# EAGLE design sensor (EAGLE 9.5.0)
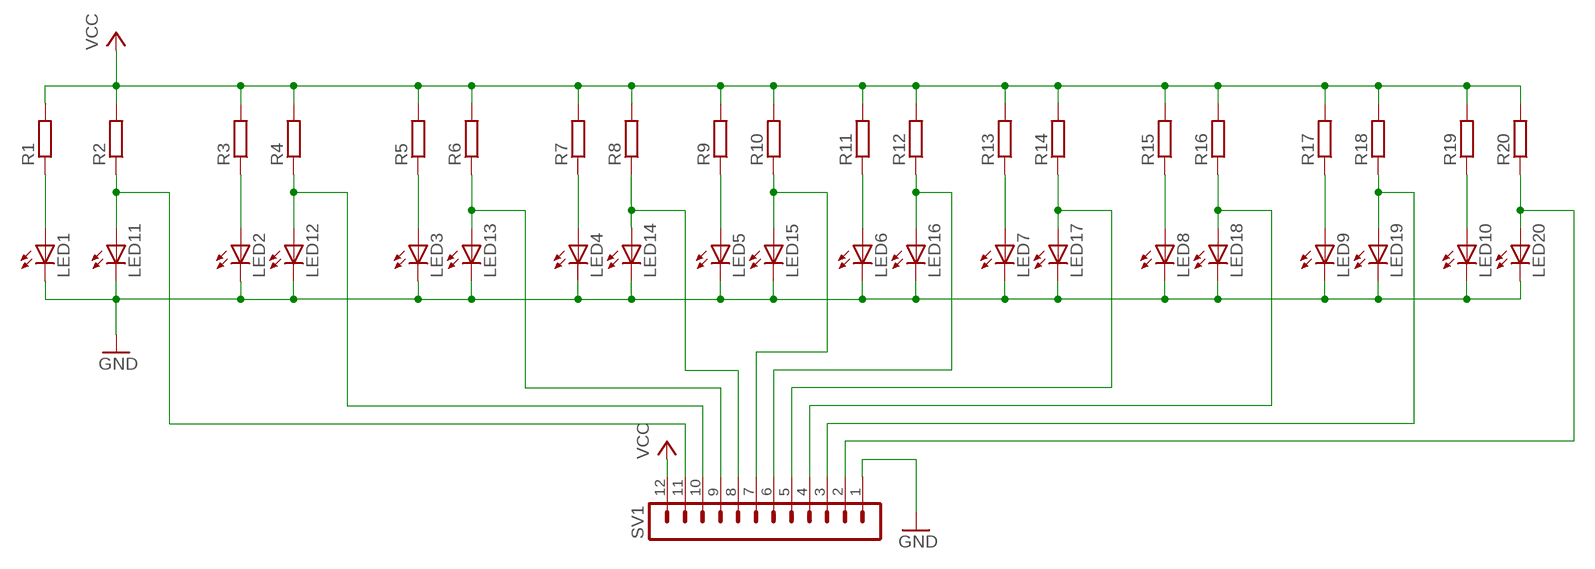
[diagram p0: schematic, sheet 1]

## Parts
LED1  LED3MM  [LED3MM]
LED2  LED3MM  [LED3MM]
LED3  LED3MM  [LED3MM]
LED4  LED3MM  [LED3MM]
LED5  LED3MM  [LED3MM]
LED6  LED3MM  [LED3MM]
LED7  LED3MM  [LED3MM]
LED8  LED3MM  [LED3MM]
LED9  LED3MM  [LED3MM]
LED10  LED3MM  [LED3MM]
LED11  LED3MM  [LED3MM]
LED12  LED3MM  [LED3MM]
LED13  LED3MM  [LED3MM]
LED14  LED3MM  [LED3MM]
LED15  LED3MM  [LED3MM]
LED16  LED3MM  [LED3MM]
LED17  LED3MM  [LED3MM]
LED18  LED3MM  [LED3MM]
LED19  LED3MM  [LED3MM]
LED20  LED3MM  [LED3MM]
R1  R-EU_0207/7  [0207/7]
R2  R-EU_0207/7  [0207/7]
R3  R-EU_0207/7  [0207/7]
R4  R-EU_0207/7  [0207/7]
R5  R-EU_0207/7  [0207/7]
R6  R-EU_0207/7  [0207/7]
R7  R-EU_0207/7  [0207/7]
R8  R-EU_0207/7  [0207/7]
R9  R-EU_0207/7  [0207/7]
R10  R-EU_0207/7  [0207/7]
R11  R-EU_0207/7  [0207/7]
R12  R-EU_0207/7  [0207/7]
R13  R-EU_0207/7  [0207/7]
R14  R-EU_0207/7  [0207/7]
R15  R-EU_0207/7  [0207/7]
R16  R-EU_0207/7  [0207/7]
R17  R-EU_0207/7  [0207/7]
R18  R-EU_0207/7  [0207/7]
R19  R-EU_0207/7  [0207/7]
R20  R-EU_0207/7  [0207/7]
SV1  MA12-1  [MA12-1]

## Nets
GND: LED1.K(C) LED2.K(C) LED3.K(C) LED4.K(C) LED5.K(C) LED6.K(C) LED7.K(C) LED8.K(C) LED9.K(C) LED10.K(C) LED11.K(C) LED12.K(C) LED13.K(C) LED14.K(C) LED15.K(C) LED16.K(C) LED17.K(C) LED18.K(C) LED19.K(C) LED20.K(C) SV1.1
N$1: LED1.A R1.1
N$2: LED11.A R2.1 SV1.11
N$3: LED2.A R3.1
N$4: LED12.A R4.1 SV1.10
N$5: LED3.A R5.1
N$6: LED13.A R6.1 SV1.9
N$7: LED4.A R7.1
N$8: LED14.A R8.1 SV1.8
N$9: LED5.A R9.1
N$10: LED15.A R10.1 SV1.7
N$11: LED6.A R11.1
N$12: LED16.A R12.1 SV1.6
N$13: LED20.A R20.1 SV1.2
N$14: LED10.A R19.1
N$15: LED19.A R18.1 SV1.3
N$16: LED9.A R17.1
N$17: LED18.A R16.1 SV1.4
N$18: LED8.A R15.1
N$19: LED17.A R14.1 SV1.5
N$20: LED7.A R13.1
VCC: R1.2 R2.2 R3.2 R4.2 R5.2 R6.2 R7.2 R8.2 R9.2 R10.2 R11.2 R12.2 R13.2 R14.2 R15.2 R16.2 R17.2 R18.2 R19.2 R20.2 SV1.12

## Library data of the parts
LED1-LED20 = adafruit:LED: LED OSRAM: - CHIPLED LG R971, LG N971, LY N971, LG Q971, LY Q971, LO R971, LY R971 LH N974, LH R974 LS Q976, LO Q976, LY Q976 LO Q996 - Hyper CHIPLED LW Q18S LB Q993, LB Q99A, LB R99A - SideLED LS A670, LO A670, LY A670, LG A670, LP A670 LB A673, LV A673, LT A673, LW A673 LH A674 LY A675 LS A676, LA A676, LO A676, LY A676, LW A676 LS A679, LY A679, LG A679 - Hyper Micro SIDELED® LS Y876, LA Y876, LO Y876, LY Y876 LT Y87S - SmartLED LW L88C, LW L88S LB L89C, LB L89S, LG L890 LS L89K, LO L89K, LY L89K LS L896, LA L896, LO L896, LY L896 - TOPLED LS T670, LO T670, LY T670, LG T670, LP T670 LSG T670, LSP T670, LSY T670, LOP T670, LYG T670 LG T671, LOG T671, LSG T671 LB T673, LV T673, LT T673, LW T673 LH T674 LS T676, LA T676, LO T676, LY T676, LB T676, LH T676, LSB T676, LW T676 LB T67C, LV T67C, LT T67C, LS T67K, LO T67K, LY T67K, LW E67C LS E67B, LA E67B, LO E67B, LY E67B, LB E67C, LV E67C, LT E67C LW T67C LS T679, LY T679, LG T679 LS T770, LO T770, LY T770, LG T770, LP T770 LB T773, LV T773, LT T773, LW T773 LH T774 LS E675, LA E675, LY E675, LS T675 LS T776, LA T776, LO T776, LY T776, LB T776 LHGB T686 LT T68C, LB T68C - Hyper Mini TOPLED® LB M676 - Mini TOPLED Santana® LG M470 LS M47K, LO M47K, LY M47K Source: http://www.osram.convergy.de/
R1-R20 = rcl:R-EU_: RESISTOR, European symbol; SPICEPREFIX: R
SV1 = con-lstb:MA12-1: PIN HEADER; OC_FARNELL: unknown; OC_NEWARK: unknown

## Board
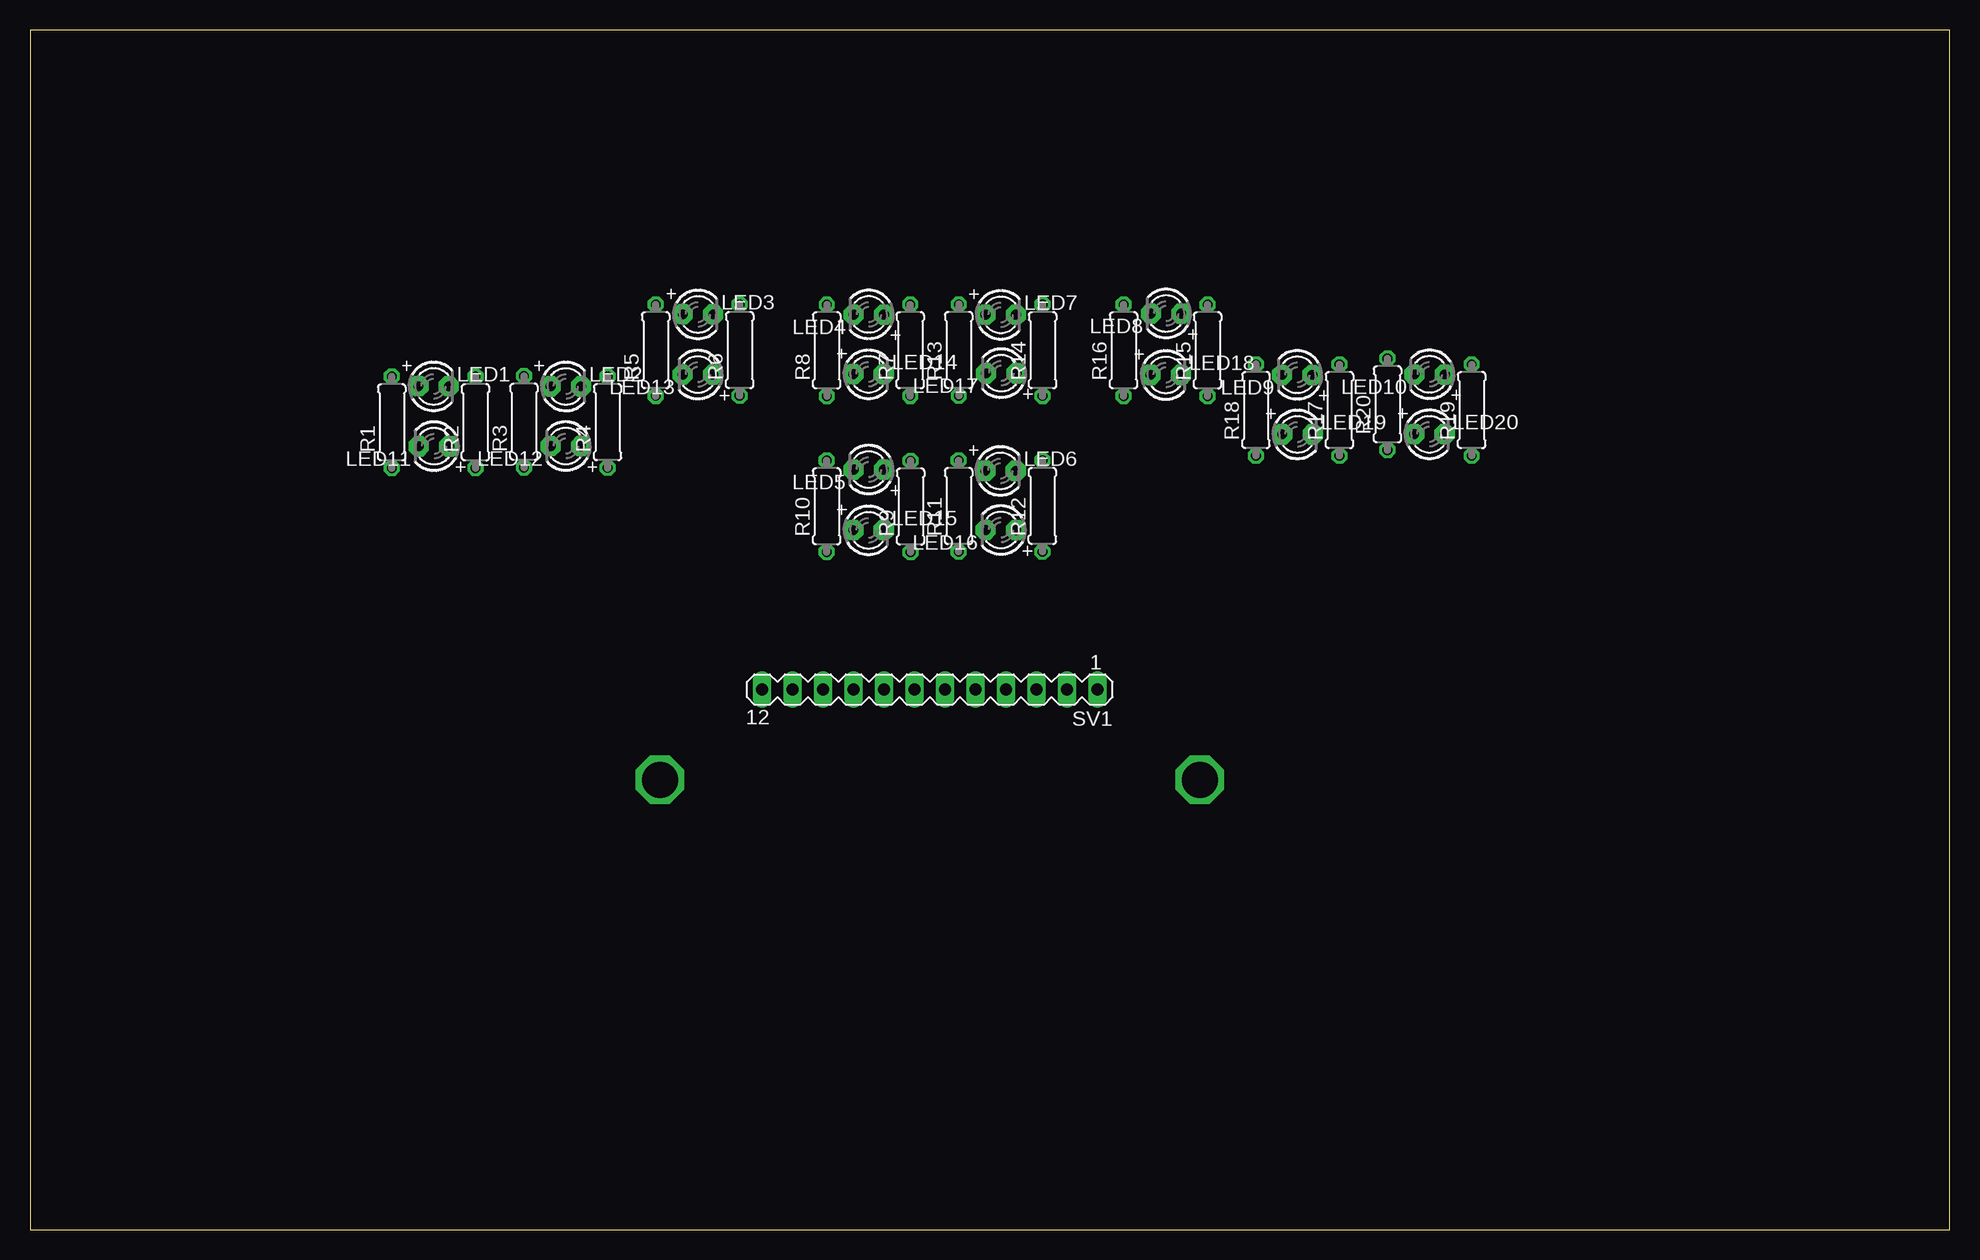
[diagram p1: board, top side]
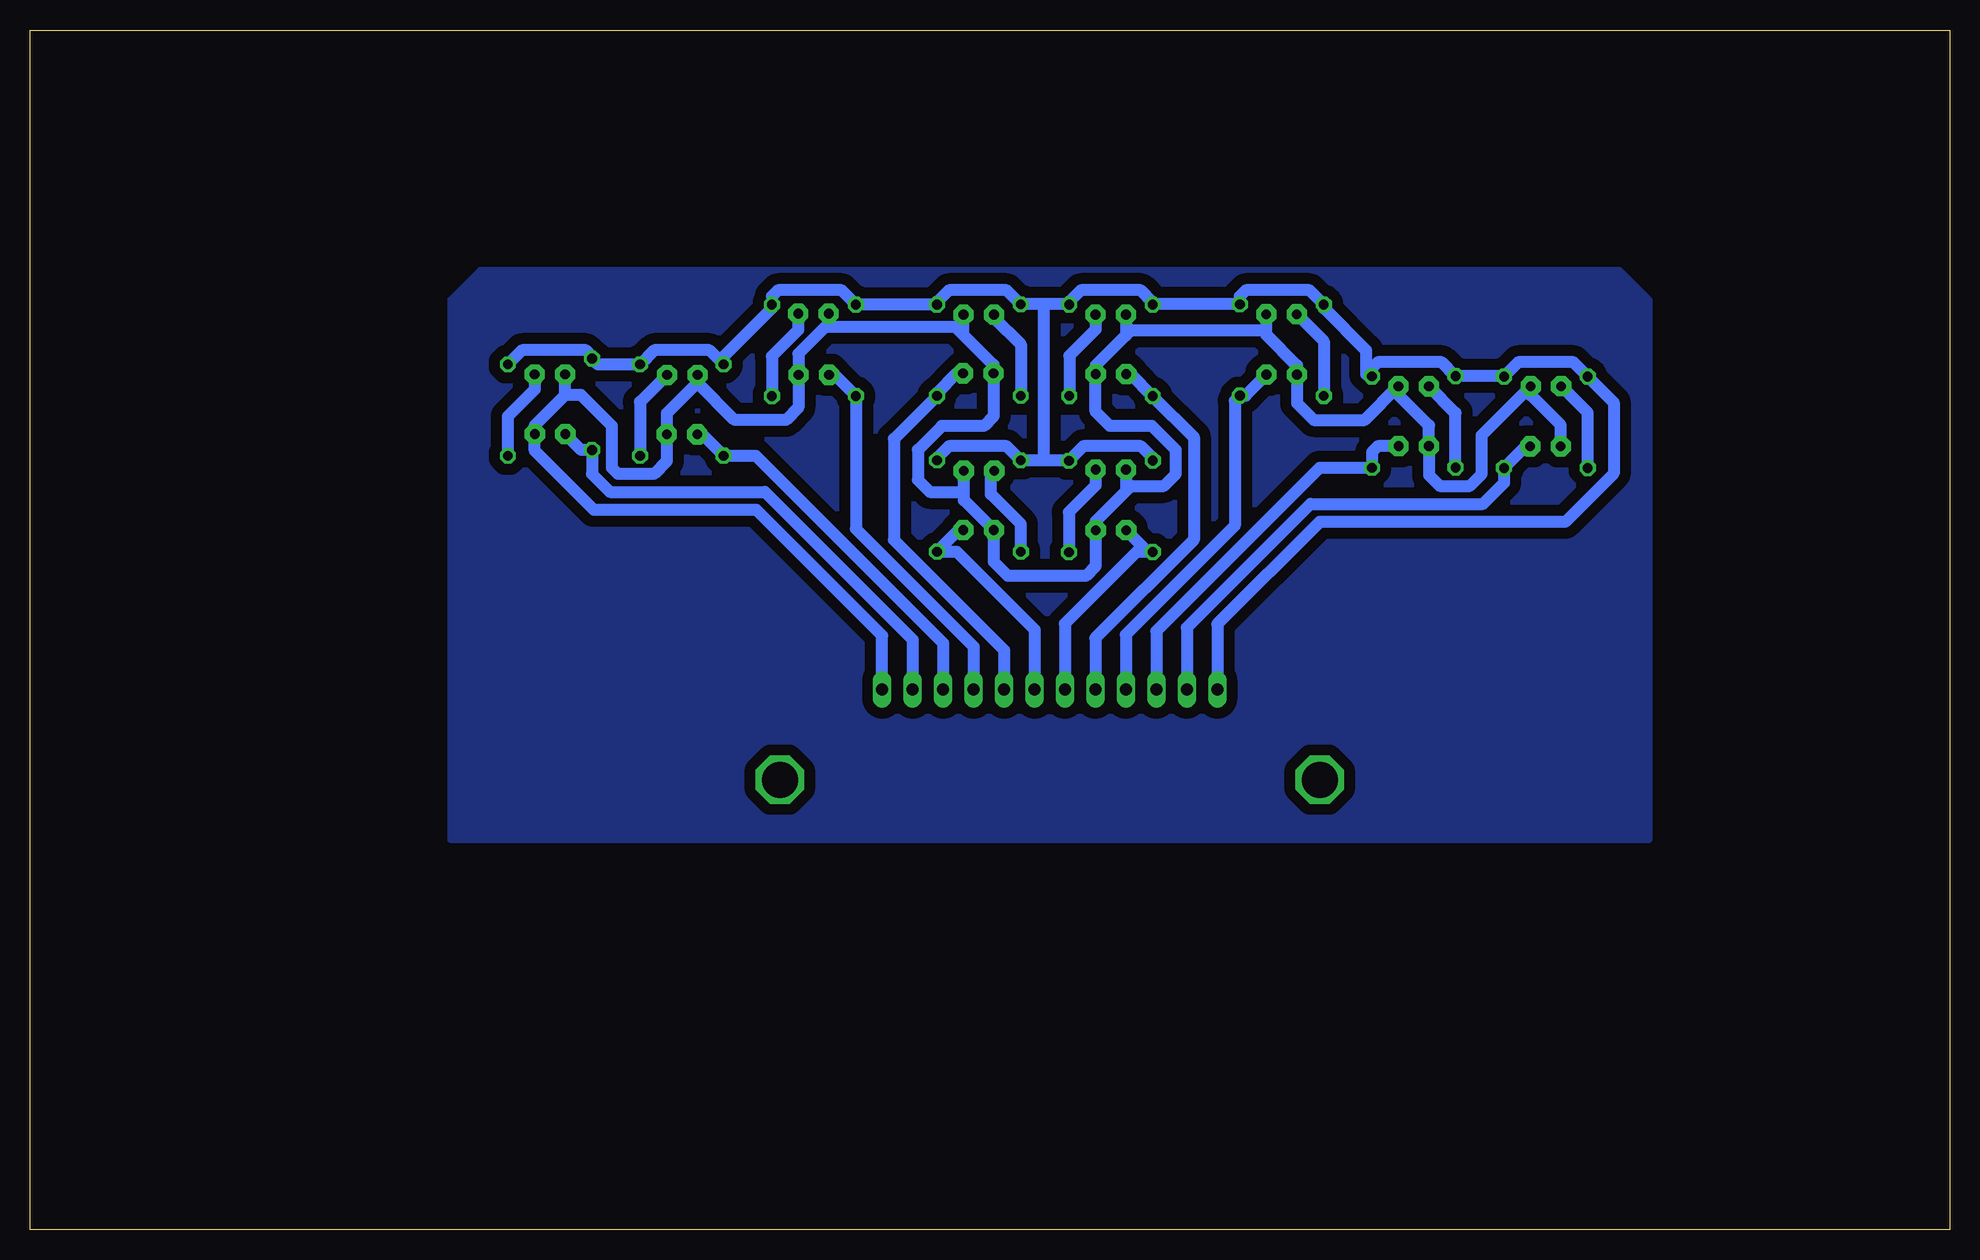
[diagram p2: board, bottom side, seen from below]

Size 160 x 100 mm. Coordinates in mm from the lower left corner, seen from the top.
Outline: 0,0 160,0 160,100 0,100 0,0
Copper layers (1*16): Top 0.035mm / dielectric 1.5mm / Bottom 0.035mm
Design rules "default *": minimum track width 6mil, minimum drill 0.35mm, track to track 36mil, track to pad 36mil, pad to pad 6mil, via to via 6mil, smd to smd 6mil, copper to edge 40mil, drill to drill 6mil, minimum pad ring 10mil, minimum via ring 8mil, stop-mask expansion 4mil, vias tented up to drill 0mil, thermal gap 10mil

### Footprints (pad centres in the part's own frame; a part is rotated, then mirrored left to right if it is on the bottom)
LED3MM = drill 0.813 pad 1.676 octagon: A -1.27,0; K 1.27,0
0207/7 = drill 0.813 octagon: 1 -3.81,0; 2 3.81,0
MA12-1 = drill 1.016 long: 1 -13.97,0; 2 -11.43,0; 3 -8.89,0; 4 -6.35,0; 5 -3.81,0; 6 -1.27,0; 7 1.27,0; 8 3.81,0; 9 6.35,0; 10 8.89,0; 11 11.43,0; 12 13.97,0

### Placement (x,y rotation side)
LED1  33.64,70.3 0 top
LED2  44.67,70.29 0 top
LED3  55.68,76.3 0 top
LED4  69.92,76.28 180 top
LED5  69.91,63.34 180 top
LED6  80.89,63.25 0 top
LED7  80.92,76.26 0 top
LED8  94.7,76.36 180 top
LED9  105.63,71.24 180 top
LED10  116.66,71.29 180 top
LED11  33.68,65.29 180 top
LED12  44.66,65.3 180 top
LED13  55.66,71.27 180 top
LED14  69.9,71.31 0 top
LED15  69.9,58.3 0 top
LED16  80.93,58.31 180 top
LED17  80.96,71.38 180 top
LED18  94.68,71.25 0 top
LED19  105.65,66.3 0 top
LED20  116.65,66.31 0 top
R1  30.16,67.3 90 top
R2  37.13,67.29 90 top
R3  41.18,67.34 90 top
R4  48.15,67.31 90 top
R5  52.16,73.3 90 top
R6  59.15,73.32 90 top
R7  73.37,73.3 90 top
R8  66.42,73.29 90 top
R9  73.4,60.28 90 top
R10  66.41,60.29 90 top
R11  77.41,60.31 90 top
R12  84.39,60.32 90 top
R13  77.42,73.32 90 top
R14  84.41,73.3 90 top
R15  98.16,73.29 90 top
R16  91.16,73.3 90 top
R17  109.15,68.31 90 top
R18  102.19,68.32 90 top
R19  120.17,68.31 90 top
R20  113.15,68.8 90 top
SV1  75,45.02 180 top

### Tracks (layer width: path | path; a pad name or v marks a point on that pad's centre or on a via)
GG
  pour Bottom: 27.5,80 122.5,80 125,77.5 125,32.5 25,32.5 25,77.5
GND
  Bottom 1: LED11.K 32.41,67.05 34.91,69.55 LED1.K 39,66.21 39,63 40,62 42.5,62 43.38,62.88 LED12.K 43.38,67.02 45.94,69.58 LED2.K 48.73,67.5 53,67.5 54.39,68.89 LED13.K 54.39,72.03 56.95,74.59 56.95,75 | 56.95,75 LED3.K | 82.16,61.5 82.16,60.81 LED16.K 79.66,55.66 78.5,54.5 72,54.5 71.17,55.33 LED15.K 71.17,59.04 68.64,61.57 | 82.16,61.5 LED6.K | 82.19,74.58 LED7.K | 82.19,74.58 79.69,72.08 LED17.K 79.69,67.81 80.5,67 84,67 86,65 86,62.5 85,61.5 82.16,61.5 | 68.65,74.56 71.17,72.04 LED14.K 71.17,68.17 70,67 66.5,67 64.5,65 64.5,63 65.5,62 68.21,62 68.64,61.57 | LED8.K 93.43,75.53 93.73,75.23 | 93.73,75.23 95.94,73.01 LED18.K 95.94,68.56 97,67.5 101.25,67.5 104.36,70.6 | LED9.K 104.36,70.6 | 104.36,70.6 106.92,68.03 LED19.K 106.92,64.08 108,63 111,63 111.5,63.5 111.5,67 114.07,69.57 115.39,69.57 | 115.39,69.57 LED10.K | 115.39,69.57 117.92,67.04 LED20.K 117.92,64.92 113,60 99.45,60 88.97,49.52 SV1.1 | LED5.K 68.64,61.57 | LED4.K 68.65,74.56 | 68.65,74.56 68.21,75 56.95,75 | 82.19,74.58 82.84,75.23 93.73,75.23
N$1
  Bottom 1: R1.1 30.16,68.09 LED1.A
N$2
  Bottom 1: LED11.A 35.33,65.29 R2.1 37.13,62.23 38.88,60.48 53.27,60.48 63.57,50.18 SV1.11
N$3
  Bottom 1: R3.1 41.18,68.07 LED2.A
N$4
  Bottom 1: LED12.A 47.66,65.3 48.15,64.81 R4.1 52.51,63.49 66.11,49.89 SV1.10
N$5
  Bottom 1: R5.1 52.16,74.04 LED3.A
N$6
  Bottom 1: LED13.A 58.69,69.51 R6.1 59.57,69.1 59.57,58.68 68.65,49.6 SV1.9
N$7
  Bottom 1: LED4.A 71.19,75.02 73.37,72.83 R7.1
N$8
  Bottom 1: LED14.A 68.24,71.31 R8.1 63,66.06 63,57.5 71.19,49.31 SV1.8
N$9
  Bottom 1: LED5.A 71.17,62.03 73.4,59.8 R9.1
N$10
  Bottom 1: LED15.A 66.81,56.48 R10.1 67.77,56.48 73.73,50.52 SV1.7
N$11
  Bottom 1: R11.1 77.41,58.8 79.91,61.3 79.91,62.97 LED6.A
N$12
  Bottom 1: LED16.A 82.59,58.31 R12.1 82.76,56.51 76.27,50.02 SV1.6
N$13
  Bottom 1: LED20.A 114.06,64.99 R20.1 113.15,62.99 111.67,61.5 98.75,61.5 86.43,49.18 SV1.2
N$14
  Bottom 1: LED10.A 117.93,70.03 120.17,67.78 R19.1
N$15
  Bottom 1: LED19.A 103.98,66.3 R18.1 99.51,64.51 83.89,48.89 SV1.3
N$16
  Bottom 1: LED9.A 109.15,68.99 R17.1
N$17
  Bottom 1: LED18.A 92.92,71.25 R16.1 91.16,58.41 81.35,48.6 SV1.4
N$18
  Bottom 1: LED8.A 95.97,74.99 98.16,72.8 R15.1
N$19
  Bottom 1: LED17.A 82.73,71.38 84.41,69.7 R14.1 88,65.9 88,57.5 78.81,48.31 SV1.5
N$20
  Bottom 1: LED7.A 79.65,76.04 77.41,73.8 R13.1
N$21  (via drill 3 pad 4)
  other vias: 52.5,37.5
N$22  (via drill 3 pad 4)
  other vias: 97.5,37.5
VCC
  Bottom 1: 48.15,71.81 47.66,72.3 42.33,72.3 R3.2 37.18,71.15 R2.2 35.94,72.3 31.35,72.3 R1.2 28,68.95 28,63.04 32.04,59 52.5,59 61.03,50.47 SV1.12 | 48.15,71.81 48.65,71.31 48.65,73.28 52.16,76.8 R5.2 53.34,78.3 58.66,78.3 59.15,77.8 R6.2 66.39,77.13 R8.2 66.42,77.31 67.41,78.3 72.41,78.3 73.37,77.33 R7.2 73.39,77.12 75.5,77.12 | 48.15,71.81 R4.2 | R12.2 84.39,64.31 83.41,65.3 78.59,65.3 R11.2 75.5,64.12 | R10.2 66.41,64.3 67.41,65.3 72.19,65.3 R9.2 73.44,64.12 75.5,64.12 | 75.5,77.12 R13.2 78.59,78.3 83.41,78.3 84.41,77.3 R14.2 R16.2 92.35,78.3 97.66,78.3 98.16,77.8 R15.2 98.16,76.8 102.19,72.77 R18.2 103.36,73.3 107.97,73.3 R17.2 112.67,72.12 R20.2 113.15,72.79 113.66,73.3 119,73.3 R19.2 | 75.5,64.12 75.5,77.12